# EAGLE schematic USB 3.0 eMMC (EAGLE 6.6.0)
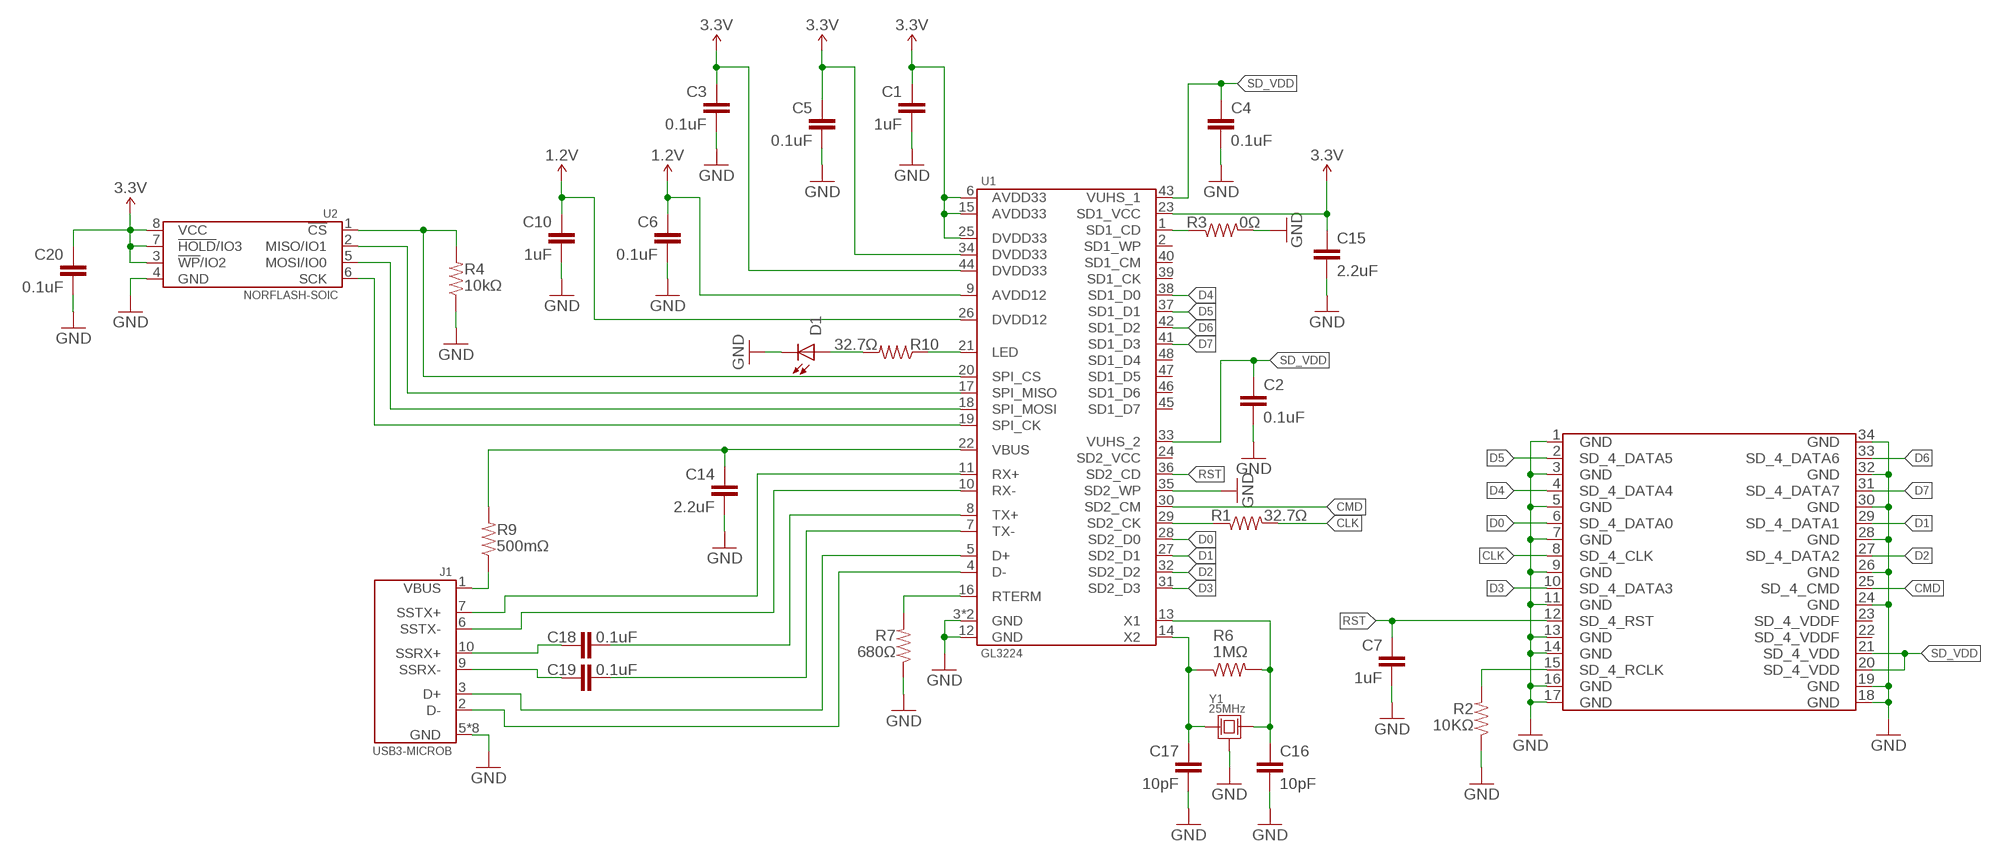
[diagram p0: schematic, sheet 1]

## Parts
C1  1uF  CAP-0402  [0402-CAP]
C2  0.1uF  CAP-0402  [0402-CAP]
C3  0.1uF  CAP-0402  [0402-CAP]
C4  0.1uF  CAP-0402  [0402-CAP]
C5  0.1uF  CAP-0402  [0402-CAP]
C6  0.1uF  CAP-0402  [0402-CAP]
C7  1uF  CAP-0402  [0402-CAP]
C10  1uF  CAP-0402  [0402-CAP]
C14  2.2uF  CAP-0402  [0402-CAP]
C15  2.2uF  CAP-0402  [0402-CAP]
C16  10pF  CAP-0402  [0402-CAP]
C17  10pF  CAP-0402  [0402-CAP]
C18  0.1uF  CAP-0402  [0402-CAP]
C19  0.1uF  CAP-0402  [0402-CAP]
C20  0.1uF  CAP-0402  [0402-CAP]
D1  LED-0603  [0603-LED]
J1  USB3-MICROB  [USB-MICROB-3.1]
R1  32.7Ω  RESISTOR-0402  [0402-RES]
R2  10KΩ  RESISTOR-0402  [0402-RES]
R3  0Ω  RESISTOR-0402  [0402-RES]
R4  10kΩ  RESISTOR-0402  [0402-RES]
R6  1MΩ  RESISTOR-0402  [0402-RES]
R7  680Ω  RESISTOR-0402  [0402-RES]
R9  500mΩ  RESISTOR-0805  [0805-RES]
R10  32.7Ω  RESISTOR-0402  [0402-RES]
U1  GL3224  [QFN48]
U2  NORFLASH-SOIC  [SOIC-8]
Y1  25MHz  CRYSTAL-3.2X2.5  [FA-238]

## Nets
1.2V: C6.1 C10.1 U1.9(AVDD12) U1.26(DVDD12)
3.3V: C1.1 C3.1 C5.1 C15.1 C20.1 U1.6(AVDD33) U1.15(AVDD33) U1.23(SD1_VCC) U1.25(DVDD33) U1.34(DVDD33) U1.44(DVDD33) U2.3(!WP!/IO2) U2.7(!HOLD!/IO3) U2.8(VCC)
CLK: R1.2
CMD: U1.30(SD2_CM)
D0: U1.28(SD2_D0)
D1: U1.27(SD2_D1)
D2: U1.32(SD2_D2)
D3: U1.31(SD2_D3)
D4: U1.38(SD1_D0)
D5: U1.37(SD1_D1)
D6: U1.42(SD1_D2)
D7: U1.41(SD1_D3)
GND: C1.2 C2.2 C3.2 C4.2 C5.2 C6.2 C7.2 C10.2 C14.2 C15.2 C16.2 C17.2 C20.2 D1.C J1.5(GND) J1.8(GND) J1.P$1(GND) J1.P$2(GND) J1.P$3(GND) J1.P$4(GND) J1.P$5(GND) J1.P$6(GND) R2.1 R3.2 R4.1 R7.1 U1.3(GND) U1.12(GND) U1.35(SD2_WP) U1.PAD(GND) U2.4(GND) Y1.2(GND) Y1.4(GND)
N$1: U1.19(SPI_CK) U2.6(SCK)
N$2: U1.18(SPI_MOSI) U2.5(MOSI/IO0)
N$3: U1.17(SPI_MISO) U2.2(MISO/IO1)
N$8: C14.1 R9.2 U1.22(VBUS)
N$10: C16.1 R6.2 U1.13(X1) Y1.3
N$11: C17.1 R6.1 U1.14(X2) Y1.1
N$12: C18.2 U1.8(TX+)
N$13: C19.2 U1.7(TX-)
N$14: J1.6(SSTX-) U1.10(RX-)
N$15: J1.7(SSTX+) U1.11(RX+)
N$17: R1.1 U1.29(SD2_CK)
N$18: R3.1 U1.1(SD1_CD)
N$19: J1.3(D+) U1.5(D+)
N$20: J1.2(D-) U1.4(D-)
N$21: R7.2 U1.16(RTERM)
N$22: R4.2 U1.20(SPI_CS) U2.1(!CS)
N$23: C18.1 J1.10(SSRX+)
N$24: C19.1 J1.9(SSRX-)
N$25: J1.1(VBUS) R9.1
N$26: R10.1 U1.21(LED)
N$27: D1.A R10.2
N$28: R2.2
RST: C7.1 U1.36(SD2_CD)
SD_VDD: C2.1 C4.1 U1.33(VUHS_2) U1.43(VUHS_1)
Unconnected: U1.2(SD1_WP) U1.24(SD2_VCC) U1.39(SD1_CK) U1.40(SD1_CM) U1.45(SD1_D7) U1.46(SD1_D6) U1.47(SD1_D5) U1.48(SD1_D4)

## Notes on the sheet
- 1 | GND | GND | 34
- 2 | SD_4_DATA5 | SD_4_DATA6 | 33
- 3 | GND | GND | 32
- 4 | SD_4_DATA4 | SD_4_DATA7 | 31
- 5 | GND | GND | 30
- 6 | SD_4_DATA0 | SD_4_DATA1 | 29
- 7 | GND | GND | 28
- 8 | SD_4_CLK | SD_4_DATA2 | 27
- 9 | GND | GND | 26
- 10 | SD_4_DATA3 | SD_4_CMD | 25
- 11 | GND | GND | 24
- 12 | SD_4_RST | SD_4_VDDF | 23
- 13 | GND | SD_4_VDDF | 22
- 14 | GND | SD_4_VDD | 21
- 15 | SD_4_RCLK | SD_4_VDD | 20
- 16 | GND | GND | 19
- 17 | GND | GND | 18

## Library data of the parts
C1-C7 C10 C14-C20 = Passives:CAP
D1 = Passives:LED
J1 = Connectors:USB3
R1-R4 R6 R7 R9 R10 = Passives:RESISTOR
U1 = GenesysLogic:GL3224
U2 = Passives:NORFLASH
Y1 = Passives:CRYSTAL